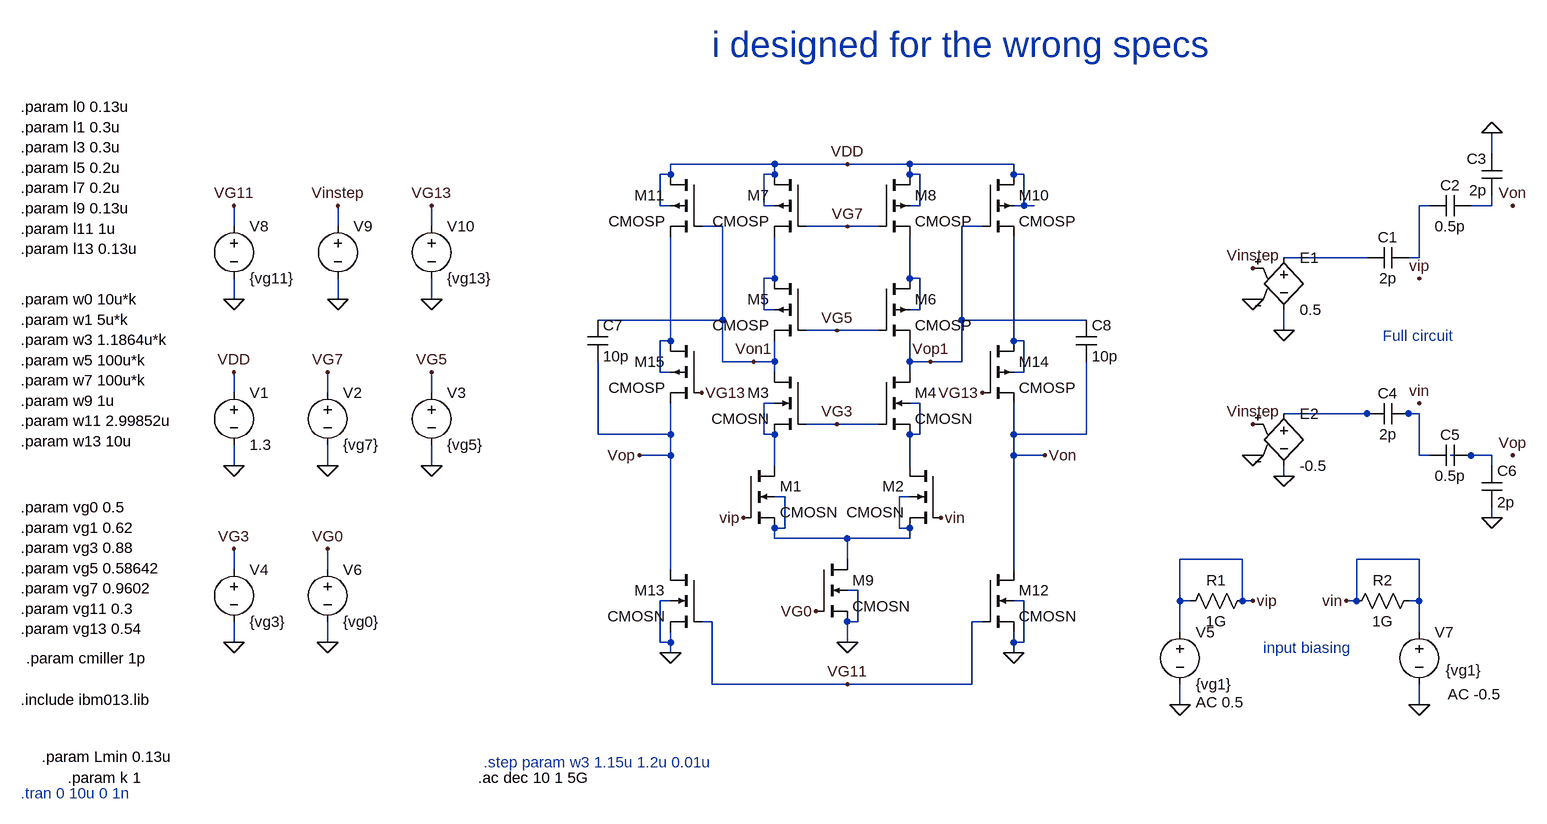
[diagram p0: schematic assignment5_test.asc]
assignment5_test.asc, the LTspice schematic file:
Version 4
SHEET 1 1232 680
WIRE 704 -480 704 -512
WIRE -400 -464 -560 -464
WIRE -288 -464 -400 -464
WIRE -192 -464 -288 -464
WIRE -32 -464 -192 -464
WIRE -560 -448 -560 -464
WIRE -560 -448 -576 -448
WIRE -400 -448 -400 -464
WIRE -400 -448 -416 -448
WIRE -192 -448 -192 -464
WIRE -176 -448 -192 -448
WIRE -32 -448 -32 -464
WIRE -16 -448 -32 -448
WIRE -576 -400 -576 -448
WIRE -560 -400 -576 -400
WIRE -416 -400 -416 -448
WIRE -400 -400 -416 -400
WIRE -176 -400 -176 -448
WIRE -176 -400 -192 -400
WIRE -16 -400 -16 -448
WIRE -16 -400 -32 -400
WIRE 0 -400 -16 -400
WIRE 608 -400 592 -400
WIRE 704 -400 704 -416
WIRE 704 -400 672 -400
WIRE -1232 -368 -1232 -400
WIRE -1072 -368 -1072 -400
WIRE -928 -368 -928 -400
WIRE -480 -368 -512 -368
WIRE -288 -368 -352 -368
WIRE -240 -368 -288 -368
WIRE -80 -368 -112 -368
WIRE 512 -320 384 -320
WIRE 592 -320 592 -400
WIRE 592 -320 576 -320
WIRE -400 -288 -400 -352
WIRE -400 -288 -416 -288
WIRE -192 -288 -192 -352
WIRE -176 -288 -192 -288
WIRE -1232 -256 -1232 -288
WIRE -1072 -256 -1072 -288
WIRE -928 -256 -928 -288
WIRE -416 -240 -416 -288
WIRE -400 -240 -416 -240
WIRE -176 -240 -176 -288
WIRE -176 -240 -192 -240
WIRE -480 -224 -480 -368
WIRE -480 -224 -672 -224
WIRE -112 -224 -112 -368
WIRE 80 -224 -112 -224
WIRE -304 -208 -352 -208
WIRE -240 -208 -304 -208
WIRE 384 -208 384 -240
WIRE -560 -192 -560 -352
WIRE -560 -192 -576 -192
WIRE -32 -192 -32 -352
WIRE -16 -192 -32 -192
WIRE -480 -160 -480 -224
WIRE -432 -160 -480 -160
WIRE -400 -160 -400 -192
WIRE -400 -160 -432 -160
WIRE -192 -160 -192 -192
WIRE -160 -160 -192 -160
WIRE -112 -160 -112 -224
WIRE -112 -160 -160 -160
WIRE -576 -144 -576 -192
WIRE -560 -144 -576 -144
WIRE -400 -144 -400 -160
WIRE -192 -144 -192 -160
WIRE -16 -144 -16 -192
WIRE -16 -144 -32 -144
WIRE -1232 -112 -1232 -144
WIRE -1088 -112 -1088 -144
WIRE -928 -112 -928 -144
WIRE -400 -96 -416 -96
WIRE -176 -96 -192 -96
WIRE 512 -80 384 -80
WIRE 528 -80 512 -80
WIRE 576 -80 560 -80
WIRE 592 -80 576 -80
WIRE -304 -64 -352 -64
WIRE -240 -64 -304 -64
WIRE -672 -48 -672 -160
WIRE -560 -48 -560 -96
WIRE -560 -48 -672 -48
WIRE -416 -48 -416 -96
WIRE -400 -48 -416 -48
WIRE -176 -48 -176 -96
WIRE -176 -48 -192 -48
WIRE -32 -48 -32 -96
WIRE 80 -48 80 -160
WIRE 80 -48 -32 -48
WIRE -560 -16 -560 -48
WIRE -560 -16 -608 -16
WIRE -32 -16 -32 -48
WIRE 16 -16 -32 -16
WIRE 592 -16 592 -80
WIRE 608 -16 592 -16
WIRE 672 -16 640 -16
WIRE 704 -16 672 -16
WIRE -1232 0 -1232 -32
WIRE -1088 0 -1088 -32
WIRE -928 0 -928 -32
WIRE -400 0 -400 -48
WIRE -192 0 -192 -48
WIRE 704 0 704 -16
WIRE 384 16 384 0
WIRE -384 48 -400 48
WIRE -192 48 -208 48
WIRE 704 80 704 64
WIRE -384 96 -384 48
WIRE -384 96 -400 96
WIRE -208 96 -208 48
WIRE -192 96 -208 96
WIRE -400 112 -400 96
WIRE -288 112 -400 112
WIRE -192 112 -192 96
WIRE -192 112 -288 112
WIRE -288 144 -288 112
WIRE 320 144 224 144
WIRE 592 144 496 144
WIRE -1232 160 -1232 128
WIRE -1088 160 -1088 128
WIRE -560 160 -560 -16
WIRE -32 160 -32 -16
WIRE -272 192 -288 192
WIRE -560 208 -576 208
WIRE -16 208 -32 208
WIRE 224 208 224 144
WIRE 240 208 224 208
WIRE 320 208 320 144
WIRE 336 208 320 208
WIRE 496 208 496 144
WIRE 496 208 480 208
WIRE 592 208 592 144
WIRE 592 208 576 208
WIRE -496 240 -512 240
WIRE -272 240 -272 192
WIRE -272 240 -288 240
WIRE -80 240 -96 240
WIRE 224 256 224 208
WIRE 592 256 592 208
WIRE -1232 272 -1232 240
WIRE -1088 272 -1088 240
WIRE -576 272 -576 208
WIRE -560 272 -560 256
WIRE -560 272 -576 272
WIRE -288 272 -288 240
WIRE -32 272 -32 256
WIRE -16 272 -16 208
WIRE -16 272 -32 272
WIRE -560 288 -560 272
WIRE -32 288 -32 272
WIRE -496 336 -496 240
WIRE -288 336 -496 336
WIRE -96 336 -96 240
WIRE -96 336 -288 336
WIRE 224 368 224 336
WIRE 592 368 592 336
FLAG -288 272 0
FLAG -1232 0 0
FLAG -1232 -144 VDD
FLAG -1088 0 0
FLAG -1088 -144 VG7
FLAG -928 0 0
FLAG -928 -144 VG5
FLAG -1232 272 0
FLAG -1232 128 VG3
FLAG 224 368 0
FLAG -1088 272 0
FLAG -1088 128 VG0
FLAG -288 -464 VDD
FLAG -288 -368 VG7
FLAG -304 -208 VG5
FLAG -304 -64 VG3
FLAG -448 80 vip
FLAG -144 80 vin
FLAG -336 224 VG0
FLAG -432 -160 Von1
FLAG -160 -160 Vop1
FLAG 592 368 0
FLAG 704 -512 0
FLAG 704 80 0
FLAG 736 -400 Von
FLAG 736 -16 Vop
FLAG 336 208 vip
FLAG 480 208 vin
FLAG 592 -288 vip
FLAG 592 -96 vin
FLAG -1232 -256 0
FLAG -1232 -400 VG11
FLAG 384 16 0
FLAG 384 -208 0
FLAG -1072 -256 0
FLAG -1072 -400 Vinstep
FLAG 336 -256 0
FLAG 336 -304 Vinstep
FLAG 336 -16 0
FLAG 336 -64 Vinstep
FLAG -560 288 0
FLAG -32 288 0
FLAG 16 -16 Von
FLAG -608 -16 Vop
FLAG -288 336 VG11
FLAG -928 -256 0
FLAG -928 -400 VG13
FLAG -512 -112 VG13
FLAG -80 -112 VG13
DATAFLAG 480 -80 ""
DATAFLAG 464 -320 ""
DATAFLAG -640 -16 ""
SYMBOL cmosn -448 0 R0
SYMATTR InstName M1
SYMATTR Value2 l={l1} w={w1} ad={2*Lmin*w1} as={2*Lmin*w1} pd={2*w1+4*Lmin} ps={2*w1+4*Lmin}
SYMBOL cmosn -144 0 M0
SYMATTR InstName M2
SYMATTR Value2 l={l1} w={w1} ad={2*Lmin*w1} as={2*Lmin*w1} pd={2*w1+4*Lmin} ps={2*w1+4*Lmin}
SYMBOL cmosn -352 -144 M0
SYMATTR InstName M3
SYMATTR Value2 l={l3} w={w3} ad={2*Lmin*w3} as={2*Lmin*w3} pd={2*w3+4*Lmin} ps={2*w3+4*Lmin}
SYMBOL cmosn -240 -144 R0
SYMATTR InstName M4
SYMATTR Value2 l={l3} w={w3} ad={2*Lmin*w3} as={2*Lmin*w3} pd={2*w3+4*Lmin} ps={2*w3+4*Lmin}
SYMBOL cmosp -352 -288 M0
SYMATTR InstName M5
SYMATTR Value2 l={l5} w={w5} ad={2*Lmin*w5} as={2*Lmin*w5} pd={2*w5+4*Lmin} ps={2*w5+4*Lmin}
SYMBOL cmosp -240 -288 R0
SYMATTR InstName M6
SYMATTR Value2 l={l5} w={w5} ad={2*Lmin*w5} as={2*Lmin*w5} pd={2*w5+4*Lmin} ps={2*w5+4*Lmin}
SYMBOL cmosp -352 -448 M0
SYMATTR InstName M7
SYMATTR Value2 l={l7} w={w7} ad={2*Lmin*w7} as={2*Lmin*w7} pd={2*w7+4*Lmin} ps={2*w7+4*Lmin}
SYMBOL cmosp -240 -448 R0
SYMATTR InstName M8
SYMATTR Value2 l={l7} w={w7} ad={2*Lmin*w7} as={2*Lmin*w7} pd={2*w7+4*Lmin} ps={2*w7+4*Lmin}
SYMBOL cmosn -336 144 R0
SYMATTR InstName M9
SYMATTR Value2 l={l0} w={w0} ad={2*Lmin*w0} as={2*Lmin*w0} pd={2*w0+4*Lmin} ps={2*w0+4*Lmin}
SYMBOL voltage -1232 -128 R0
WINDOW 123 0 0 Left 0
WINDOW 39 0 0 Left 0
SYMATTR InstName V1
SYMATTR Value 1.3
SYMBOL voltage -1088 -128 R0
WINDOW 123 0 0 Left 0
WINDOW 39 0 0 Left 0
SYMATTR InstName V2
SYMATTR Value {vg7}
SYMBOL voltage -928 -128 R0
WINDOW 123 0 0 Left 0
WINDOW 39 0 0 Left 0
SYMATTR InstName V3
SYMATTR Value {vg5}
SYMBOL voltage -1232 144 R0
WINDOW 123 0 0 Left 0
WINDOW 39 0 0 Left 0
SYMATTR InstName V4
SYMATTR Value {vg3}
SYMBOL voltage 224 240 R0
WINDOW 123 24 124 Left 2
WINDOW 39 0 0 Left 0
SYMATTR Value2 AC 0.5
SYMATTR InstName V5
SYMATTR Value {vg1}
SYMBOL voltage -1088 144 R0
WINDOW 123 0 0 Left 0
WINDOW 39 0 0 Left 0
SYMATTR InstName V6
SYMATTR Value {vg0}
SYMBOL voltage 592 240 R0
WINDOW 123 44 112 Left 2
WINDOW 39 0 0 Left 0
WINDOW 3 41 75 Left 2
SYMATTR Value2 AC -0.5
SYMATTR Value {vg1}
SYMATTR InstName V7
SYMBOL cap 576 -336 R90
WINDOW 0 0 32 VBottom 2
WINDOW 3 32 32 VTop 2
SYMATTR InstName C1
SYMATTR Value 2p
SYMBOL cap 672 -416 R90
WINDOW 0 0 32 VBottom 2
WINDOW 3 32 32 VTop 2
SYMATTR InstName C2
SYMATTR Value 0.5p
SYMBOL cap 720 -416 R180
WINDOW 0 24 56 Left 2
WINDOW 3 24 8 Left 2
SYMATTR InstName C3
SYMATTR Value 2p
SYMBOL cap 512 -64 R270
WINDOW 0 32 32 VTop 2
WINDOW 3 0 32 VBottom 2
SYMATTR InstName C4
SYMATTR Value 2p
SYMBOL cap 608 0 R270
WINDOW 0 32 32 VTop 2
WINDOW 3 0 32 VBottom 2
SYMATTR InstName C5
SYMATTR Value 0.5p
SYMBOL cap 688 0 R0
SYMATTR InstName C6
SYMATTR Value 2p
SYMBOL voltage -1232 -384 R0
WINDOW 123 0 0 Left 0
WINDOW 39 0 0 Left 0
SYMATTR InstName V8
SYMATTR Value {vg11}
SYMBOL e 384 -336 R0
SYMATTR InstName E1
SYMATTR Value 0.5
SYMBOL e 384 -96 R0
SYMATTR InstName E2
SYMATTR Value -0.5
SYMBOL voltage -1072 -384 R0
WINDOW 123 0 0 Left 0
WINDOW 39 0 0 Left 0
WINDOW 3 24 96 Invisible 2
SYMATTR Value PULSE(0 0.1 1f 1f 1f 10000)
SYMATTR InstName V9
SYMBOL cmosp -80 -448 R0
SYMATTR InstName M10
SYMATTR Value2 l={l9} w={w9} ad={2*Lmin*w9} as={2*Lmin*w9} pd={2*w9+4*Lmin} ps={2*w9+4*Lmin}
SYMBOL cmosp -512 -448 M0
SYMATTR InstName M11
SYMATTR Value2 l={l9} w={w9} ad={2*Lmin*w9} as={2*Lmin*w9} pd={2*w9+4*Lmin} ps={2*w9+4*Lmin}
SYMBOL cmosn -80 160 R0
SYMATTR InstName M12
SYMATTR Value2 l={l11} w={w11} ad={2*Lmin*w11} as={2*Lmin*w11} pd={2*w11+4*Lmin} ps={2*w11+4*Lmin}
SYMBOL cmosn -512 160 M0
SYMATTR InstName M13
SYMATTR Value2 l={l11} w={w11} ad={2*Lmin*w11} as={2*Lmin*w11} pd={2*w11+4*Lmin} ps={2*w11+4*Lmin}
SYMBOL cmosp -80 -192 R0
SYMATTR InstName M14
SYMATTR Value2 l={l13} w={w13} ad={2*Lmin*w13} as={2*Lmin*w13} pd={2*w13+4*Lmin} ps={2*w13+4*Lmin}
SYMBOL voltage -928 -384 R0
WINDOW 123 0 0 Left 0
WINDOW 39 0 0 Left 0
SYMATTR InstName V10
SYMATTR Value {vg13}
SYMBOL cmosp -512 -192 M0
SYMATTR InstName M15
SYMATTR Value2 l={l13} w={w13} ad={2*Lmin*w13} as={2*Lmin*w13} pd={2*w13+4*Lmin} ps={2*w13+4*Lmin}
SYMBOL cap -688 -224 R0
SYMATTR InstName C7
SYMATTR Value 10p
SYMBOL cap 64 -224 R0
SYMATTR InstName C8
SYMATTR Value 10p
SYMBOL res 336 192 R90
WINDOW 0 0 56 VBottom 2
WINDOW 3 32 56 VTop 2
SYMATTR InstName R1
SYMATTR Value 1G
SYMBOL res 592 192 R90
WINDOW 0 0 56 VBottom 2
WINDOW 3 32 56 VTop 2
SYMATTR InstName R2
SYMATTR Value 1G
TEXT -1560 -552 Left 2 !.param l0 0.13u\n.param l1 0.3u\n.param l3 0.3u\n.param l5 0.2u\n.param l7 0.2u\n.param l9 0.13u\n.param l11 1u\n.param l13 0.13u
TEXT -1560 -256 Left 2 !.param w0 10u*k\n.param w1 5u*k\n.param w3 1.1864u*k\n.param w5 100u*k\n.param w7 100u*k\n.param w9 1u\n.param w11 2.99852u\n.param w13 10u
TEXT -1560 64 Left 2 !.param vg0 0.5\n.param vg1 0.62\n.param vg3 0.88\n.param vg5 0.58642\n.param vg7 0.9602\n.param vg11 0.3\n.param vg13 0.54
TEXT -856 480 Left 2 !.ac dec 10 1 5G
TEXT -1560 360 Left 2 !.include ibm013.lib
TEXT -848 456 Left 2 ;.step param w3 1.15u 1.2u 0.01u
TEXT 536 -200 Left 2 ;Full circuit
TEXT 352 280 Left 2 ;input biasing
TEXT -1552 296 Left 2 !.param cmiller 1p
TEXT -1528 448 Left 2 !.param Lmin 0.13u
TEXT -1488 480 Left 2 !.param k 1
TEXT -496 -648 Left 5 ;i designed for the wrong specs
TEXT -1560 504 Left 2 ;.tran 0 10u 0 1n

The netlist it stands for:
* assignment5_test.asc
M1 N008 vip N013 N013 CMOSN l={l1} w={w1} ad={2*Lmin*w1} as={2*Lmin*w1} pd={2*w1+4*Lmin} ps={2*w1+4*Lmin}
M2 N009 vin N013 N013 CMOSN l={l1} w={w1} ad={2*Lmin*w1} as={2*Lmin*w1} pd={2*w1+4*Lmin} ps={2*w1+4*Lmin}
M3 Von1 VG3 N008 N008 CMOSN l={l3} w={w3} ad={2*Lmin*w3} as={2*Lmin*w3} pd={2*w3+4*Lmin} ps={2*w3+4*Lmin}
M4 Vop1 VG3 N009 N009 CMOSN l={l3} w={w3} ad={2*Lmin*w3} as={2*Lmin*w3} pd={2*w3+4*Lmin} ps={2*w3+4*Lmin}
M5 N004 VG5 Von1 N004 CMOSP l={l5} w={w5} ad={2*Lmin*w5} as={2*Lmin*w5} pd={2*w5+4*Lmin} ps={2*w5+4*Lmin}
M6 N005 VG5 Vop1 N005 CMOSP l={l5} w={w5} ad={2*Lmin*w5} as={2*Lmin*w5} pd={2*w5+4*Lmin} ps={2*w5+4*Lmin}
M7 VDD VG7 N004 VDD CMOSP l={l7} w={w7} ad={2*Lmin*w7} as={2*Lmin*w7} pd={2*w7+4*Lmin} ps={2*w7+4*Lmin}
M8 VDD VG7 N005 VDD CMOSP l={l7} w={w7} ad={2*Lmin*w7} as={2*Lmin*w7} pd={2*w7+4*Lmin} ps={2*w7+4*Lmin}
M9 N013 VG0 0 0 CMOSN l={l0} w={w0} ad={2*Lmin*w0} as={2*Lmin*w0} pd={2*w0+4*Lmin} ps={2*w0+4*Lmin}
V1 VDD 0 1.3
V2 VG7 0 {vg7}
V3 VG5 0 {vg5}
V4 VG3 0 {vg3}
V5 vip 0 {vg1} AC 0.5
V6 VG0 0 {vg0}
V7 vin 0 {vg1} AC -0.5
C1 N001 N003 2p
C2 N002 N001 0.5p
C3 N002 0 2p
C4 N010 N011 2p
C5 N011 N012 0.5p
C6 N012 0 2p
V8 VG11 0 {vg11}
E1 N003 0 Vinstep 0 0.5
E2 N010 0 Vinstep 0 -0.5
V9 Vinstep 0 PULSE(0 0.1 1f 1f 1f 10000)
M10 VDD Vop1 N007 VDD CMOSP l={l9} w={w9} ad={2*Lmin*w9} as={2*Lmin*w9} pd={2*w9+4*Lmin} ps={2*w9+4*Lmin}
M11 VDD Von1 N006 VDD CMOSP l={l9} w={w9} ad={2*Lmin*w9} as={2*Lmin*w9} pd={2*w9+4*Lmin} ps={2*w9+4*Lmin}
M12 Von VG11 0 0 CMOSN l={l11} w={w11} ad={2*Lmin*w11} as={2*Lmin*w11} pd={2*w11+4*Lmin} ps={2*w11+4*Lmin}
M13 Vop VG11 0 0 CMOSN l={l11} w={w11} ad={2*Lmin*w11} as={2*Lmin*w11} pd={2*w11+4*Lmin} ps={2*w11+4*Lmin}
M14 N007 VG13 Von N007 CMOSP l={l13} w={w13} ad={2*Lmin*w13} as={2*Lmin*w13} pd={2*w13+4*Lmin} ps={2*w13+4*Lmin}
V10 VG13 0 {vg13}
M15 N006 VG13 Vop N006 CMOSP l={l13} w={w13} ad={2*Lmin*w13} as={2*Lmin*w13} pd={2*w13+4*Lmin} ps={2*w13+4*Lmin}
C7 Von1 Vop 10p
C8 Vop1 Von 10p
R1 vip vip 1G
R2 vin vin 1G
.model NMOS NMOS
.model PMOS PMOS
.lib standard.mos
.param l0 0.13u
.param l1 0.3u
.param l3 0.3u
.param l5 0.2u
.param l7 0.2u
.param l9 0.13u
.param l11 1u
.param l13 0.13u
.param w0 10u*k
.param w1 5u*k
.param w3 1.1864u*k
.param w5 100u*k
.param w7 100u*k
.param w9 1u
.param w11 2.99852u
.param w13 10u
.param vg0 0.5
.param vg1 0.62
.param vg3 0.88
.param vg5 0.58642
.param vg7 0.9602
.param vg11 0.3
.param vg13 0.54
.ac dec 10 1 5G
.include ibm013.lib
* .step param w3 1.15u 1.2u 0.01u
* Full circuit
* input biasing
.param cmiller 1p
.param Lmin 0.13u
.param k 1
* i designed for the wrong specs
* .tran 0 10u 0 1n
.backanno
.end